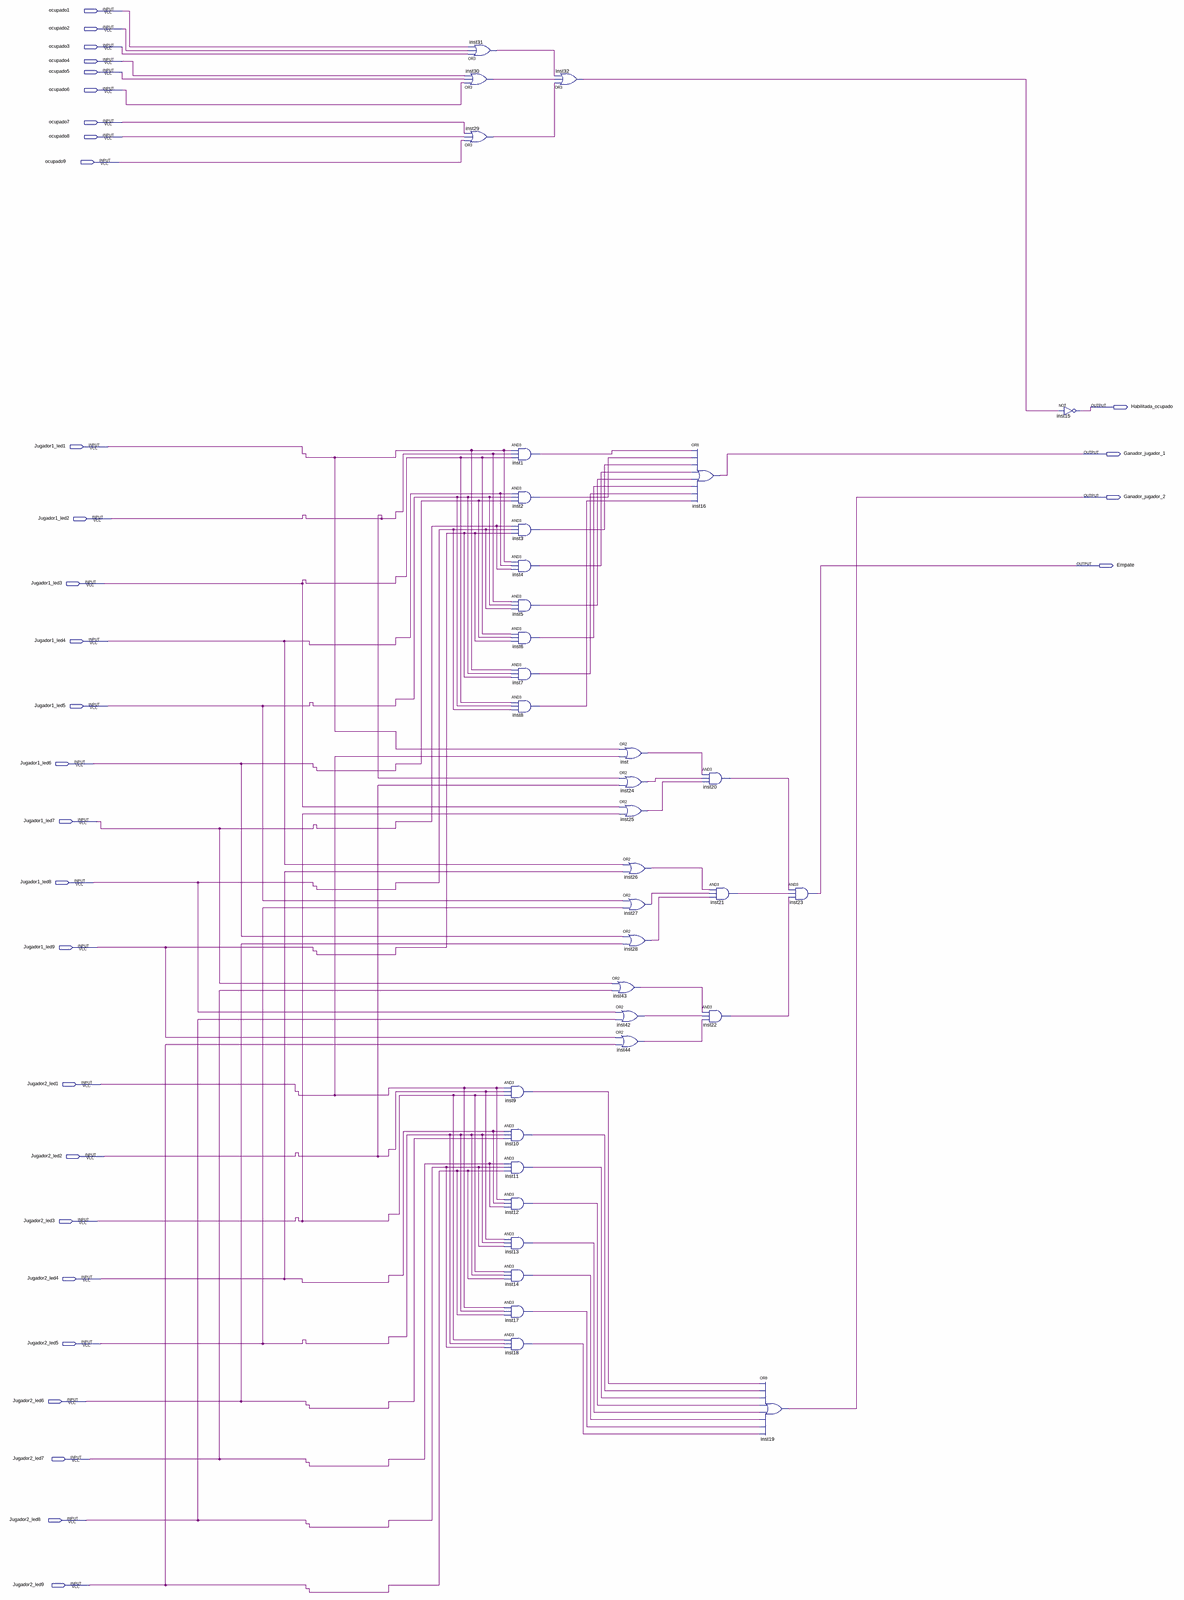
[diagram p0: schematic sheet, whole]
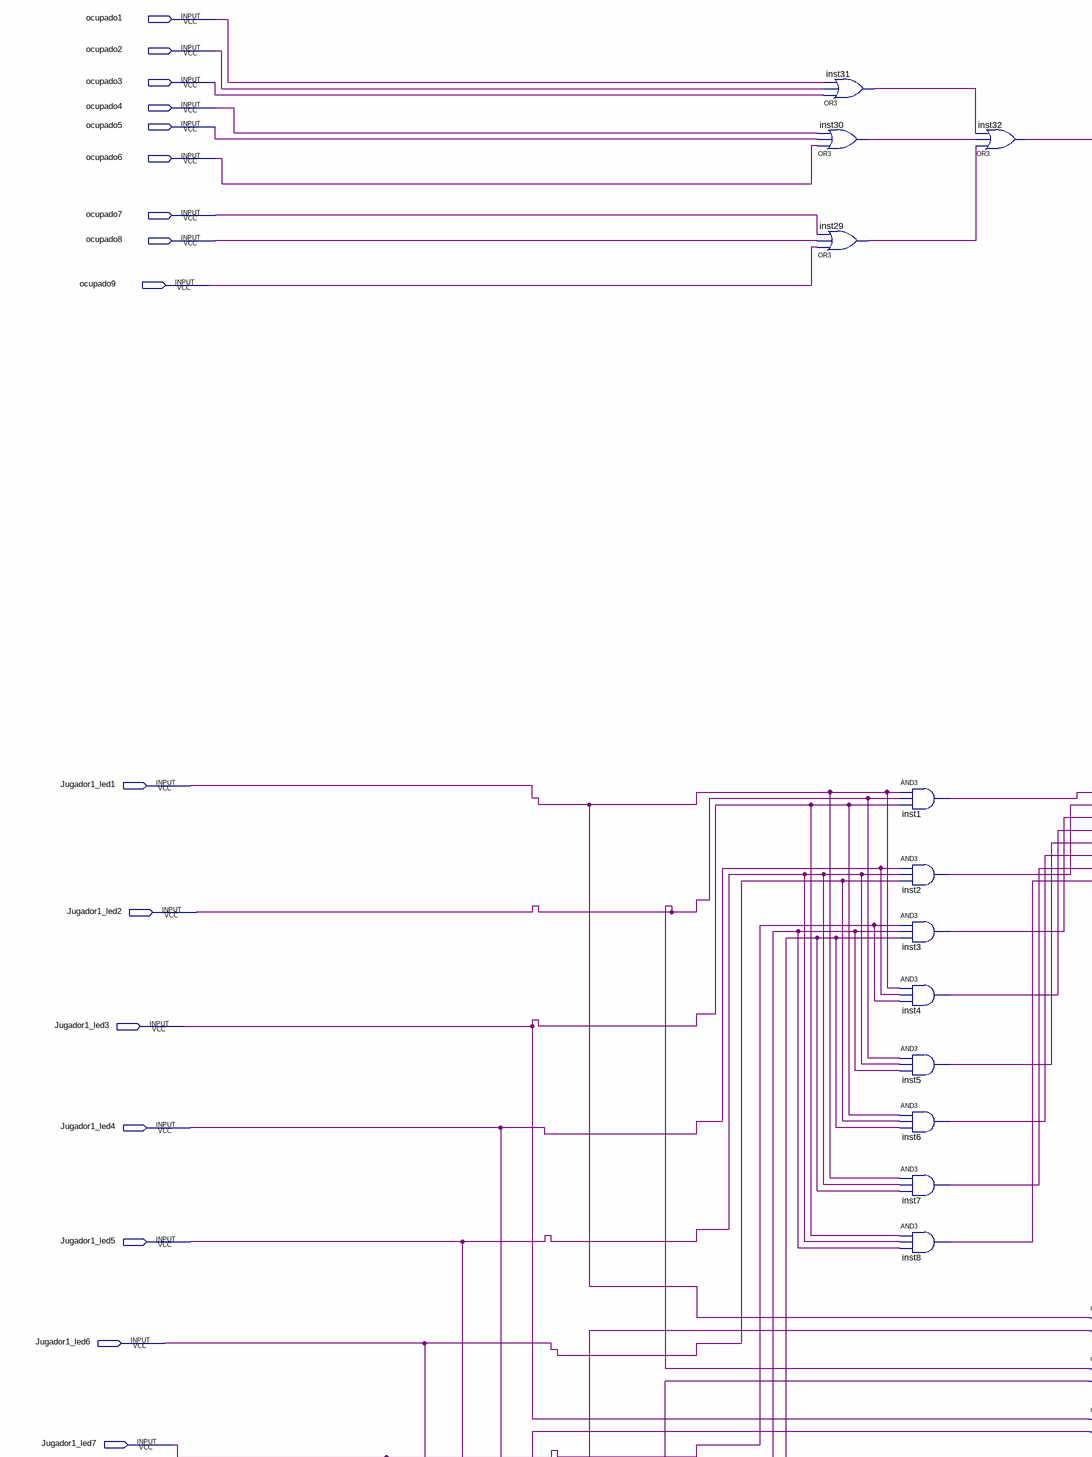
[diagram p1: schematic sheet, upper left part]
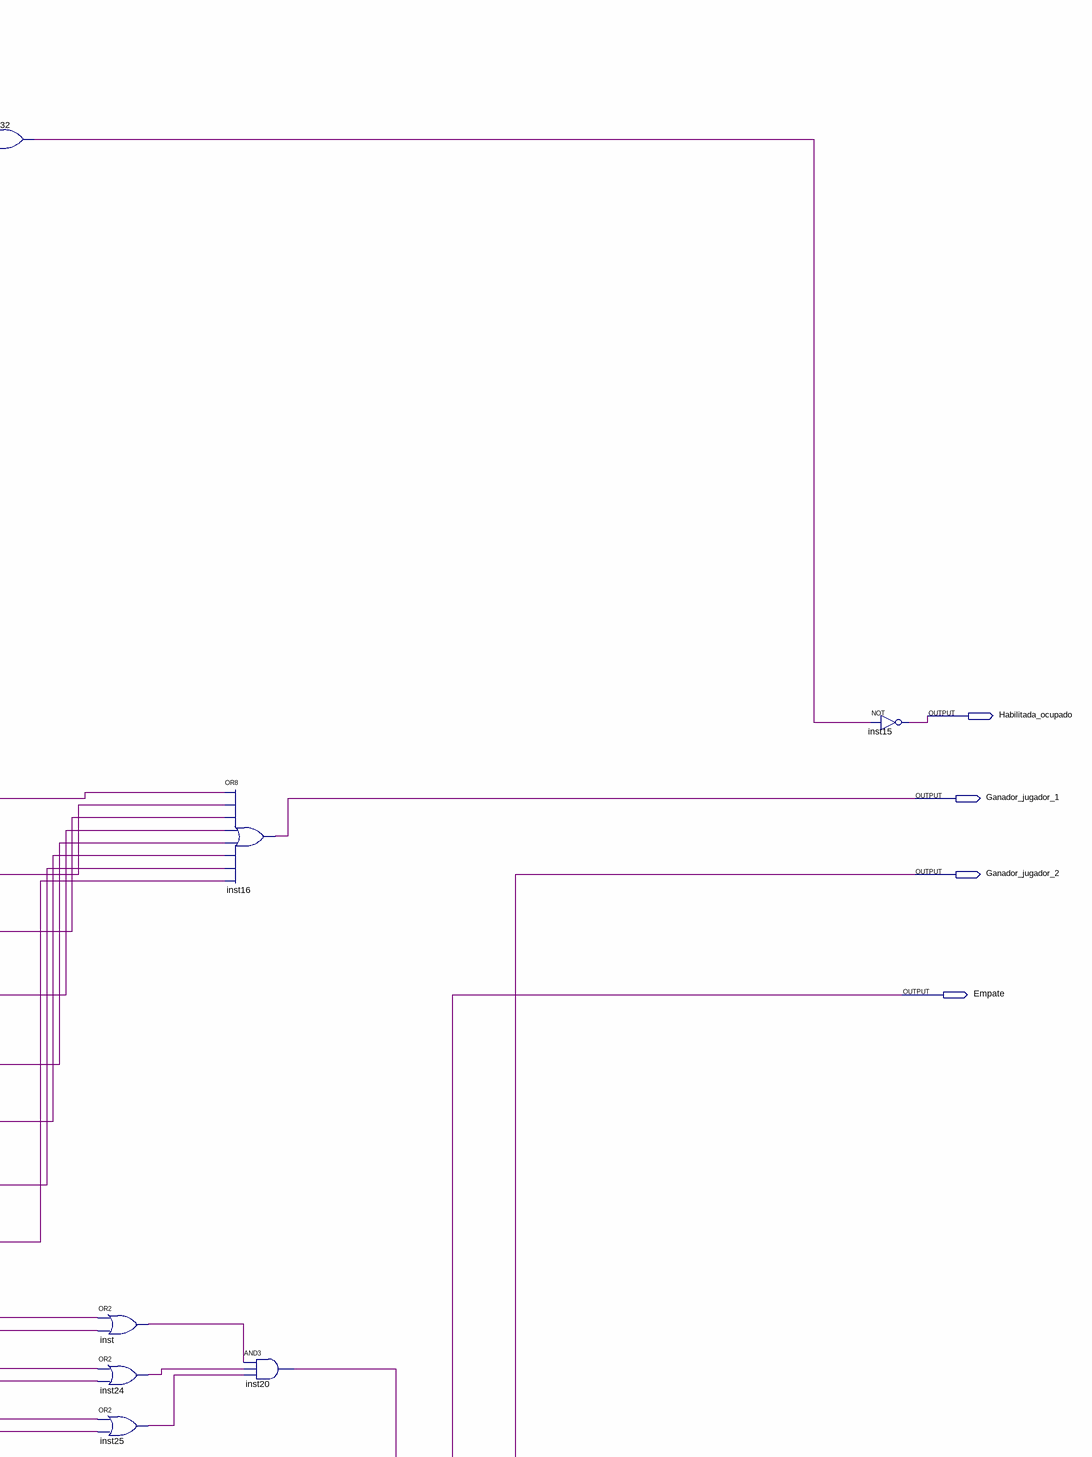
[diagram p2: schematic sheet, upper right part]
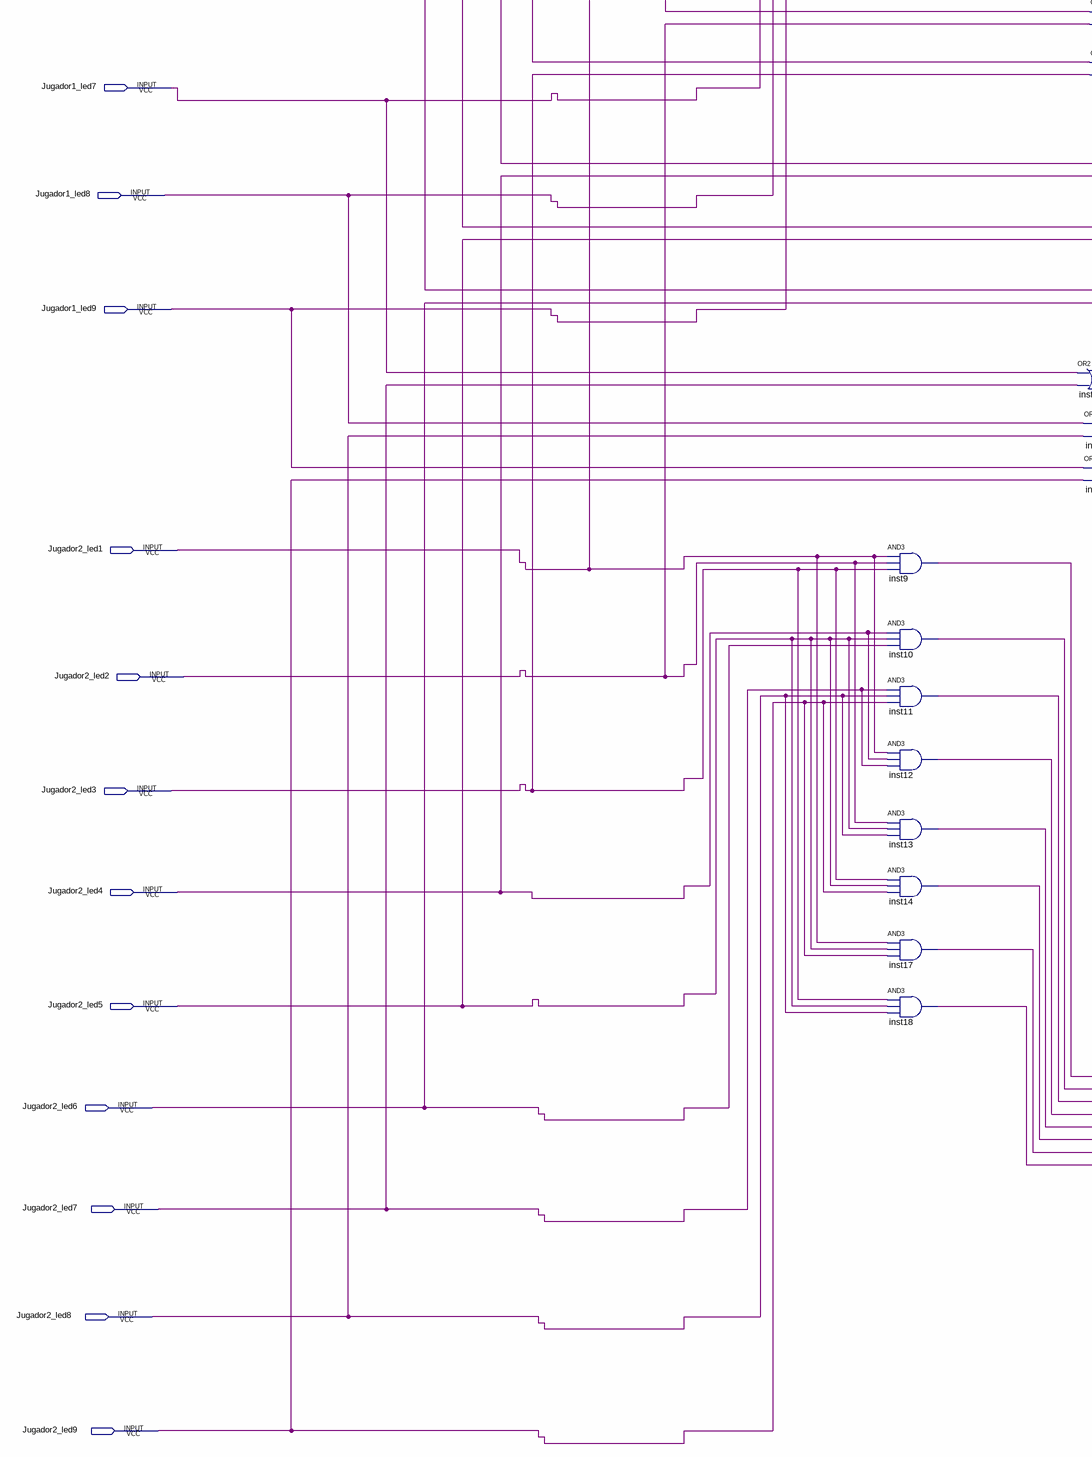
[diagram p3: schematic sheet, lower left part]
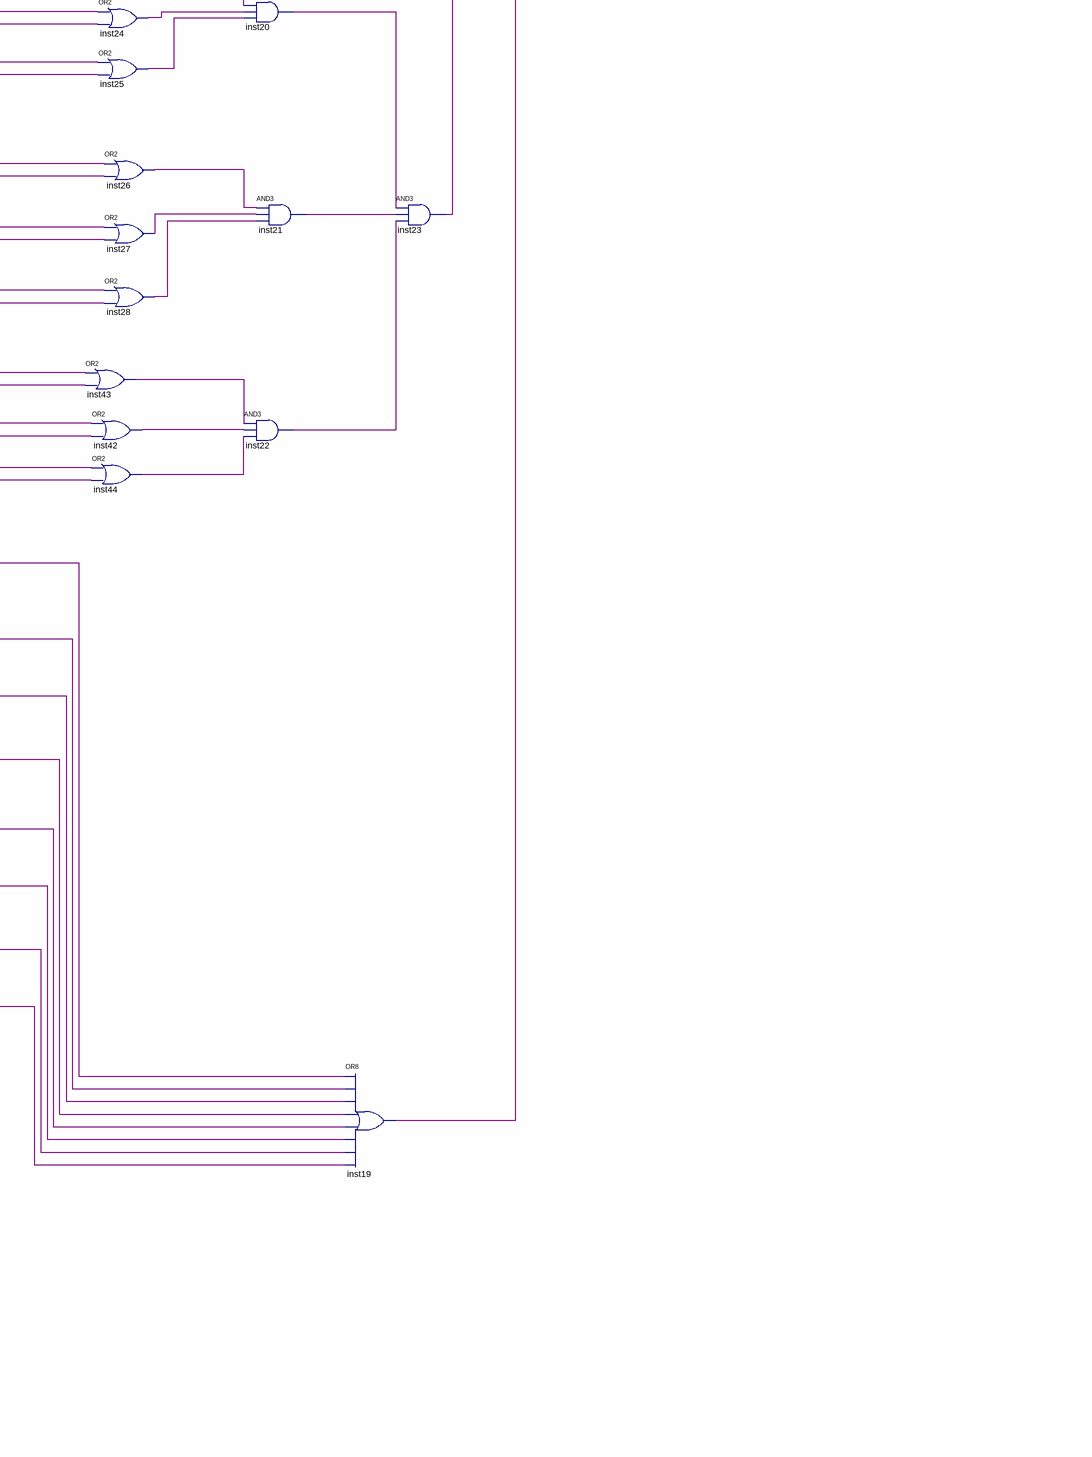
[diagram p4: schematic sheet, lower right part]
// Quartus schematic jugadas_ganadoras.bdf as structural Verilog: 36 symbols, 31 pins
module jugadas_ganadoras (
  input  ocupado1,
  input  ocupado2,
  input  ocupado3,
  input  ocupado4,
  input  ocupado5,
  input  ocupado6,
  input  ocupado7,
  input  ocupado8,
  input  ocupado9,
  input  Jugador1_led1,
  input  Jugador1_led2,
  input  Jugador1_led3,
  input  Jugador1_led4,
  input  Jugador1_led5,
  input  Jugador1_led6,
  input  Jugador1_led7,
  input  Jugador1_led8,
  input  Jugador1_led9,
  input  Jugador2_led1,
  input  Jugador2_led2,
  input  Jugador2_led3,
  input  Jugador2_led4,
  input  Jugador2_led5,
  input  Jugador2_led6,
  input  Jugador2_led7,
  input  Jugador2_led8,
  input  Jugador2_led9,
  output Habilitada_ocupado,
  output Ganador_jugador_1,
  output Ganador_jugador_2,
  output Empate
);

  wire inst1_out, inst2_out, inst3_out, inst4_out, inst5_out, inst6_out, inst7_out, inst8_out, inst9_out,
       inst10_out, inst11_out, inst12_out, inst13_out, inst14_out, inst17_out, inst18_out, inst20_out,
       inst21_out, inst22_out, inst24_out, inst25_out, inst26_out, inst27_out, inst28_out, inst29_out,
       inst30_out, inst31_out, inst32_out, inst42_out, inst43_out, inst44_out, inst_out;

  or inst31 (inst31_out, ocupado3, ocupado2, ocupado1);
  or inst30 (inst30_out, ocupado6, ocupado5, ocupado4);
  or inst29 (inst29_out, ocupado9, ocupado8, ocupado7);
  and inst1 (inst1_out, Jugador1_led1, Jugador1_led2, Jugador1_led3);
  and inst2 (inst2_out, Jugador1_led4, Jugador1_led5, Jugador1_led6);
  and inst3 (inst3_out, Jugador1_led7, Jugador1_led8, Jugador1_led9);
  and inst4 (inst4_out, Jugador1_led1, Jugador1_led4, Jugador1_led7);
  and inst5 (inst5_out, Jugador1_led2, Jugador1_led5, Jugador1_led8);
  and inst6 (inst6_out, Jugador1_led3, Jugador1_led6, Jugador1_led9);
  and inst7 (inst7_out, Jugador1_led1, Jugador1_led5, Jugador1_led9);
  and inst8 (inst8_out, Jugador1_led3, Jugador1_led5, Jugador1_led8);
  and inst9 (inst9_out, Jugador2_led1, Jugador2_led2, Jugador2_led3);
  and inst10 (inst10_out, Jugador2_led4, Jugador2_led5, Jugador2_led6);
  and inst11 (inst11_out, Jugador2_led7, Jugador2_led8, Jugador2_led9);
  and inst12 (inst12_out, Jugador2_led1, Jugador2_led4, Jugador2_led7);
  and inst13 (inst13_out, Jugador2_led2, Jugador2_led5, Jugador2_led8);
  and inst14 (inst14_out, Jugador2_led3, Jugador2_led5, Jugador2_led9);
  and inst17 (inst17_out, Jugador2_led1, Jugador2_led5, Jugador2_led9);
  and inst18 (inst18_out, Jugador2_led3, Jugador2_led5, Jugador2_led8);
  or inst32 (inst32_out, inst29_out, inst30_out, inst31_out);
  or inst43 (inst43_out, Jugador1_led7, Jugador2_led7);
  or inst (inst_out, Jugador1_led1, Jugador2_led1);
  or inst24 (inst24_out, Jugador1_led2, Jugador2_led2);
  or inst25 (inst25_out, Jugador1_led3, Jugador2_led3);
  or inst26 (inst26_out, Jugador1_led4, Jugador2_led4);
  or inst27 (inst27_out, Jugador1_led5, Jugador2_led5);
  or inst28 (inst28_out, Jugador1_led6, Jugador2_led6);
  or inst42 (inst42_out, Jugador1_led8, Jugador2_led8);
  or inst44 (inst44_out, Jugador1_led9, Jugador2_led9);
  or inst16 (Ganador_jugador_1, inst1_out, inst2_out, inst3_out, inst4_out, inst5_out, inst6_out, inst7_out, inst8_out);
  and inst20 (inst20_out, inst_out, inst24_out, inst25_out);
  and inst21 (inst21_out, inst26_out, inst27_out, inst28_out);
  and inst22 (inst22_out, inst43_out, inst42_out, inst44_out);
  or inst19 (Ganador_jugador_2, inst9_out, inst10_out, inst11_out, inst12_out, inst13_out, inst14_out, inst17_out, inst18_out);
  and inst23 (Empate, inst20_out, inst21_out, inst22_out);
  not inst15 (Habilitada_ocupado, inst32_out);
endmodule
